# EAGLE design svd20 (EAGLE 6.6.0)
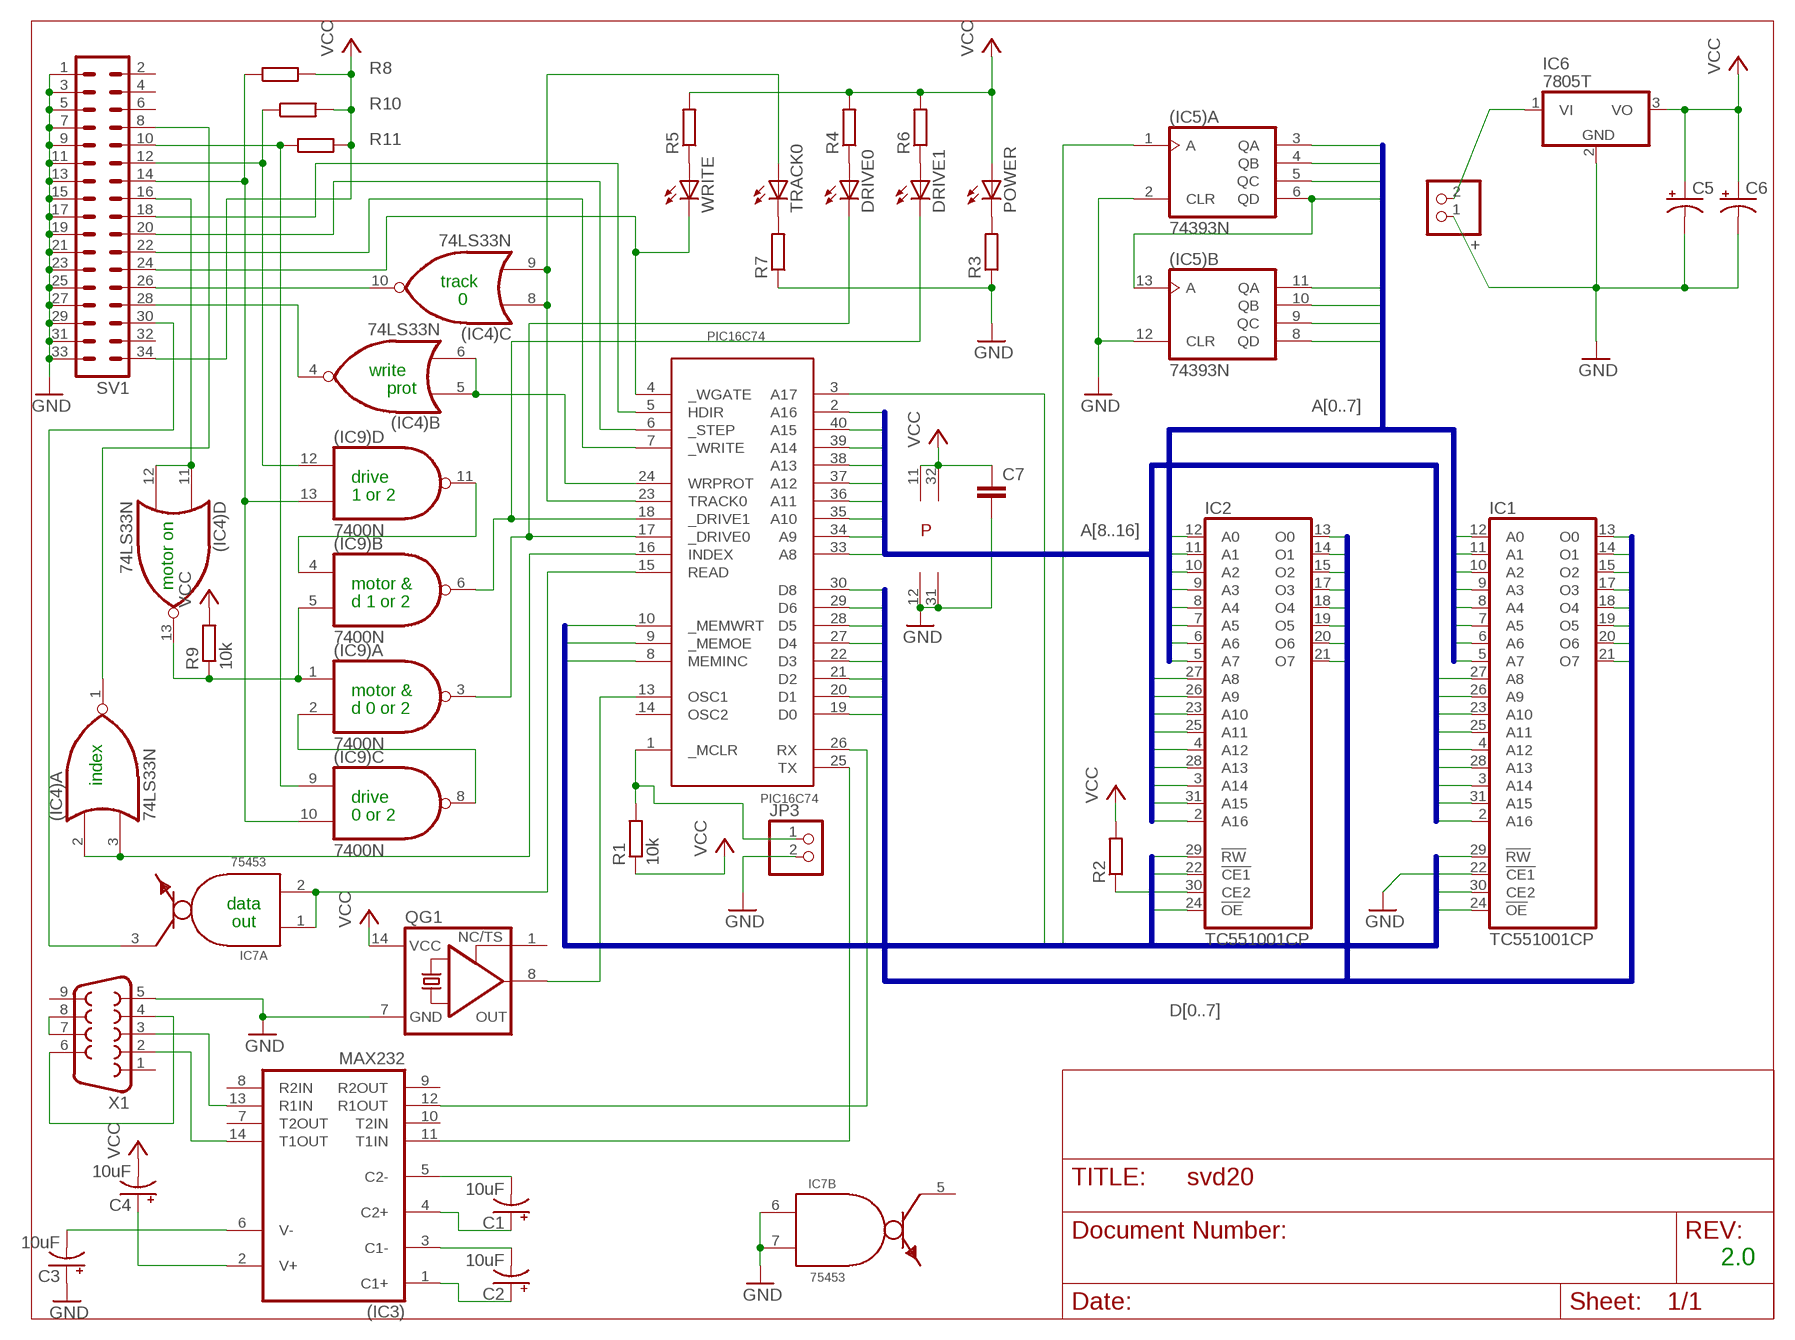
[diagram p0: schematic, sheet 1]

## Parts
(IC3)  MAX232  [DIL16]
(IC4)  74LS33N  [DIL14]
(IC5)  74393N  [DIL14]
(IC9)  7400N  [DIL14]
+  PINHD-1X2  [1X02]
C1  10uF  CPOL-USE2-5  [E2-5]
C2  10uF  CPOL-USE2-5  [E2-5]
C3  10uF  CPOL-USE2-5  [E2-5]
C4  10uF  CPOL-USE2-5  [E2-5]
C5  CPOL-USE2-5  [E2-5]
C6  CPOL-USE2-5  [E2-5]
C7  C2,5-3  [C2.5-3]
DRIVE0  LED3MM  [LED3MM]
DRIVE1  LED3MM  [LED3MM]
IC1  TC551001CP  [DIL32]
IC2  TC551001CP  [DIL32]
IC6  7805T  [TO220H]
IC7  75453  [DIL08]
JP3  PINHD-1X2  [1X02]
PIC16C74  PIC16C74  SVD-PIC16C74  [DIL40]
POWER  LED3MM  [LED3MM]
QG1  XO-14  [DIL14S]
R1  10k  R-EU_0204/5  [0204/5]
R2  R-EU_0204/5  [0204/5]
R3  R-EU_0204/5  [0204/5]
R4  R-EU_0204/5  [0204/5]
R5  R-EU_0204/5  [0204/5]
R6  R-EU_0204/5  [0204/5]
R7  R-EU_0204/5  [0204/5]
R8  R-EU_0204/5  [0204/5]
R9  10k  R-EU_0204/5  [0204/5]
R10  R-EU_0204/5  [0204/5]
R11  R-EU_0204/5  [0204/5]
SV1  ML34  [ML34]
TRACK0  LED3MM  [LED3MM]
WRITE  LED3MM  [LED3MM]
X1  F09HP  [F09HP]

## Nets
!OE: IC1.24(!OE) IC2.24(!OE) PIC16C74.9(_MEMOE)
!WE: IC1.29(!RW) IC2.29(!RW) PIC16C74.10(_MEMWRT)
A0: (IC5).3(A:QA) IC1.12(A0) IC2.12(A0)
A1: (IC5).4(A:QB) IC1.11(A1) IC2.11(A1)
A2: (IC5).5(A:QC) IC1.10(A2) IC2.10(A2)
A3: (IC5).6(A:QD) (IC5).13(B:A) IC1.9(A3) IC2.9(A3)
A4: (IC5).11(B:QA) IC1.8(A4) IC2.8(A4)
A5: (IC5).10(B:QB) IC1.7(A5) IC2.7(A5)
A6: (IC5).9(B:QC) IC1.6(A6) IC2.6(A6)
A7: (IC5).8(B:QD) IC1.5(A7) IC2.5(A7)
A8: IC1.27(A8) IC2.27(A8) PIC16C74.33(A8)
A9: IC1.26(A9) IC2.26(A9) PIC16C74.34(A9)
A10: IC1.23(A10) IC2.23(A10) PIC16C74.35(A10)
A11: IC1.25(A11) IC2.25(A11) PIC16C74.36(A11)
A12: IC1.4(A12) IC2.4(A12) PIC16C74.37(A12)
A13: IC1.28(A13) IC2.28(A13) PIC16C74.38(A13)
A14: IC1.3(A14) IC2.3(A14) PIC16C74.39(A14)
A15: IC1.31(A15) IC2.31(A15) PIC16C74.40(A15)
A16: IC1.2(A16) IC2.2(A16) PIC16C74.2(A16)
A17: IC1.30(CE2) IC2.22(!CE1) PIC16C74.3(A17)
CLK: (IC5).1(A:A) PIC16C74.8(MEMINC)
D0: IC1.13(O0) IC2.13(O0) PIC16C74.19(D0)
D1: IC1.14(O1) IC2.14(O1) PIC16C74.20(D1)
D2: IC1.15(O2) IC2.15(O2) PIC16C74.21(D2)
D3: IC1.17(O3) IC2.17(O3) PIC16C74.22(D3)
D4: IC1.18(O4) IC2.18(O4) PIC16C74.27(D4)
D5: IC1.19(O5) IC2.19(O5) PIC16C74.28(D5)
D6: IC1.20(O6) IC2.20(O6) PIC16C74.29(D6)
D7: IC1.21(O7) IC2.21(O7) PIC16C74.30(D8)
GND [GND]: (IC5).2(A:CLR) (IC5).12(B:CLR) +.1 C3.+ C5.- C6.- C7.2 IC1.22(!CE1) IC6.2(GND) IC7.6(B:I0) IC7.7(B:I1) JP3.2 PIC16C74.12(GND) PIC16C74.31(GND) QG1.7(GND) R3.1 R7.1 SV1.1 SV1.3 SV1.5 SV1.7 SV1.9 SV1.11 SV1.13 SV1.15 SV1.17 SV1.19 SV1.21 SV1.23 SV1.25 SV1.27 SV1.29 SV1.31 SV1.33 X1.5
N$1: IC2.30(CE2) R2.1
N$2: JP3.1 PIC16C74.1(_MCLR) R1.2
N$3: (IC3).1(C1+) C2.+
N$4: (IC3).3(C1-) C2.-
N$5: (IC3).4(C2+) C1.+
N$6: (IC3).5(C2-) C1.-
N$7: (IC3).2(V+) C4.+
N$8: PIC16C74.13(OSC1) QG1.8(OUT)
N$9: (IC3).12(R1OUT) PIC16C74.26(RX)
N$10: (IC9).6(B:O) DRIVE1.K(C) PIC16C74.18(_DRIVE1)
N$11: (IC4).11(D:I0) (IC4).12(D:I1) SV1.16
N$12: (IC9).12(D:I0) R10.1 SV1.12
N$13: (IC4).13(D:O) (IC9).1(A:I0) (IC9).5(B:I1) R9.1
N$14: (IC4).1(A:O) SV1.8
N$15: PIC16C74.4(_WGATE) SV1.24 WRITE.K(C)
N$16: PIC16C74.7(_WRITE) SV1.22
N$17: (IC4).10(C:O) SV1.26
N$18: X1.7 X1.8
N$19: IC7.1(A:I0) IC7.2(A:I1) PIC16C74.15(READ)
N$20: (IC9).4(B:I0) (IC9).11(D:O)
N$22: (IC4).8(C:I0) (IC4).9(C:I1) PIC16C74.23(TRACK0) TRACK0.A
N$23: (IC9).3(A:O) DRIVE0.K(C) PIC16C74.17(_DRIVE0)
N$24: (IC3).11(T1IN) PIC16C74.25(TX)
N$25: (IC3).13(R1IN) X1.3
N$26: X1.4 X1.6
N$27: (IC3).14(T1OUT) X1.2
N$28: (IC3).6(V-) C3.-
N$29 [Output]: (IC4).2(A:I0) (IC4).3(A:I1) PIC16C74.16(INDEX)
N$30 [VCC]: +.2 IC6.1(VI)
N$32: POWER.K(C) R3.2
N$33: DRIVE0.A R4.1
N$34: DRIVE1.A R6.1
N$35: R5.1 WRITE.A
N$36: R7.2 TRACK0.K(C)
N$40 [Output]: IC7.3(A:O) SV1.30
N$41: (IC4).5(B:I0) (IC4).6(B:I1) PIC16C74.24(WRPROT)
N$42: (IC9).9(C:I0) R11.1 SV1.10
N$43: (IC9).2(A:I1) (IC9).8(C:O)
N$45: (IC4).4(B:O) SV1.28
N$47: PIC16C74.6(_STEP) SV1.20
N$48: PIC16C74.5(HDIR) SV1.18
N$51: (IC9).10(C:I1) (IC9).13(D:I1) R8.1 SV1.14
VCC [VCC]: C4.- C5.+ C6.+ C7.1 IC6.3(VO) PIC16C74.11(VCC) PIC16C74.32(VCC) POWER.A QG1.14(VCC) R1.1 R2.2 R4.2 R5.2 R6.2 R8.2 R9.2 R10.2 R11.2 SV1.34
Unconnected: (IC3).7(T2OUT) (IC3).8(R2IN) (IC3).9(R2OUT) (IC3).10(T2IN) IC1.1(NC) IC2.1(NC) IC7.5(B:O) PIC16C74.14(OSC2) QG1.1(TS) SV1.2 SV1.4 SV1.6 SV1.32 X1.1 X1.9

## Buses
D[0..7]
A[0..7]
A[8..16]
A17,!OE,!WE,CLK

## Notes on the sheet
- track
- 0
- write
- prot
- drive
- 1 or 2
- motor on | motor &
- d 1 or 2
- motor &
- d 0 or 2
- index
- drive
- 0 or 2
- data
- out
- 2.0

## Power pins joined to a net without a drawn wire
GND: (IC3).15(GND) (IC4).7(P:GND) (IC5).7(P:GND) (IC9).7(P:GND) IC1.16(GND) IC2.16(GND) IC7.4(P:GND)
VCC: (IC3).16(VCC) (IC4).14(P:VCC) (IC5).14(P:VCC) (IC9).14(P:VCC) IC1.32(VCC) IC2.32(VCC) IC7.8(P:VCC)

## Library data of the parts
(IC3) = maxim:MAX232: RS232 TRANSCEIVER; MF: MAXIM; MPN: MAX232ACPE+; OC_FARNELL: 9723773; OC_NEWARK: 68K4544
(IC4) = 74xx-us:74*33: Quad 2-input NOR buffer, open collector
(IC5) = 74xx-us:74*393: Dual 4-bit decade and binary COUNTER
(IC9) = 74xx-us:74*00: Quad 2-input NAND gate
+ JP3 = pinhead:PINHD-1X2: PIN HEADER
C1-C6 = rcl:CPOL-US: POLARIZED CAPACITOR, American symbol
C7 = capacitor-wima:C: CAPACITOR naming: grid - package width
DRIVE0 DRIVE1 POWER TRACK0 WRITE = led:LED: LED OSRAM: - CHIPLED LG R971, LG N971, LY N971, LG Q971, LY Q971, LO R971, LY R971 LH N974, LH R974 LS Q976, LO Q976, LY Q976 LO Q996 - Hyper CHIPLED LW Q18S LB Q993, LB Q99A, LB R99A - SideLED LS A670, LO A670, LY A670, LG A670, LP A670 LB A673, LV A673, LT A673, LW A673 LH A674 LY A675 LS A676, LA A676, LO A676, LY A676, LW A676 LS A679, LY A679, LG A679 - Hyper Micro SIDELED® LS Y876, LA Y876, LO Y876, LY Y876 LT Y87S - SmartLED LW L88C, LW L88S LB L89C, LB L89S, LG L890 LS L89K, LO L89K, LY L89K LS L896, LA L896, LO L896, LY L896 - TOPLED LS T670, LO T670, LY T670, LG T670, LP T670 LSG T670, LSP T670, LSY T670, LOP T670, LYG T670 LG T671, LOG T671, LSG T671 LB T673, LV T673, LT T673, LW T673 LH T674 LS T676, LA T676, LO T676, LY T676, LB T676, LH T676, LSB T676, LW T676 LB T67C, LV T67C, LT T67C, LS T67K, LO T67K, LY T67K, LW E67C LS E67B, LA E67B, LO E67B, LY E67B, LB E67C, LV E67C, LT E67C LW T67C LS T679, LY T679, LG T679 LS T770, LO T770, LY T770, LG T770, LP T770 LB T773, LV T773, LT T773, LW T773 LH T774 LS E675, LA E675, LY E675, LS T675 LS T776, LA T776, LO T776, LY T776, LB T776 LHGB T686 LT T68C, LB T68C - Hyper Mini TOPLED® LB M676 - Mini TOPLED Santana® LG M470 LS M47K, LO M47K, LY M47K Source: http://www.osram.convergy.de LUXEON: - LUMILED® LXK2-PW12-R00, LXK2-PW12-S00, LXK2-PW14-U00, LXK2-PW14-V00 LXK2-PM12-R00, LXK2-PM12-S00, LXK2-PM14-U00 LXK2-PE12-Q00, LXK2-PE12-R00, LXK2-PE12-S00, LXK2-PE14-T00, LXK2-PE14-U00 LXK2-PB12-K00, LXK2-PB12-L00, LXK2-PB12-M00, LXK2-PB14-N00, LXK2-PB14-P00, LXK2-PB14-Q00 LXK2-PR12-L00, LXK2-PR12-M00, LXK2-PR14-Q00, LXK2-PR14-R00 LXK2-PD12-Q00, LXK2-PD12-R00, LXK2-PD12-S00 LXK2-PH12-R00, LXK2-PH12-S00 LXK2-PL12-P00, LXK2-PL12-Q00, LXK2-PL12-R00 Source: www.luxeon.com KINGBRIGHT: KA-3528ASYC Source: www.kingbright.com
IC1 IC2 = memory:TC551001CP: MEMORY
IC6 = linear:78*: Positive VOLTAGE REGULATOR Source: http://cache.national.com/ds/LM/LM78L05.pdf http://www.fairchildsemi.com/ds/LM/LM7805.pdf
IC7 = Erics:75453: Dual NAND peripheral driver
PIC16C74 = Erics:SVD-PIC16C74
QG1 = crystal:XO-: CRYSTAL; OC_FARNELL: unknown; OC_NEWARK: unknown
R1-R11 = rcl:R-EU_: RESISTOR, European symbol
SV1 = con-harting-ml:ML34: HARTING; OC_FARNELL: unknown; OC_NEWARK: unknown
X1 = con-subd:F09: SUB-D; OC_FARNELL: unknown; OC_NEWARK: unknown

## Net classes
1 VCC: width 0.635 mm
2 GND: width 0.635 mm
3 Output: width 0.635 mm

## Board
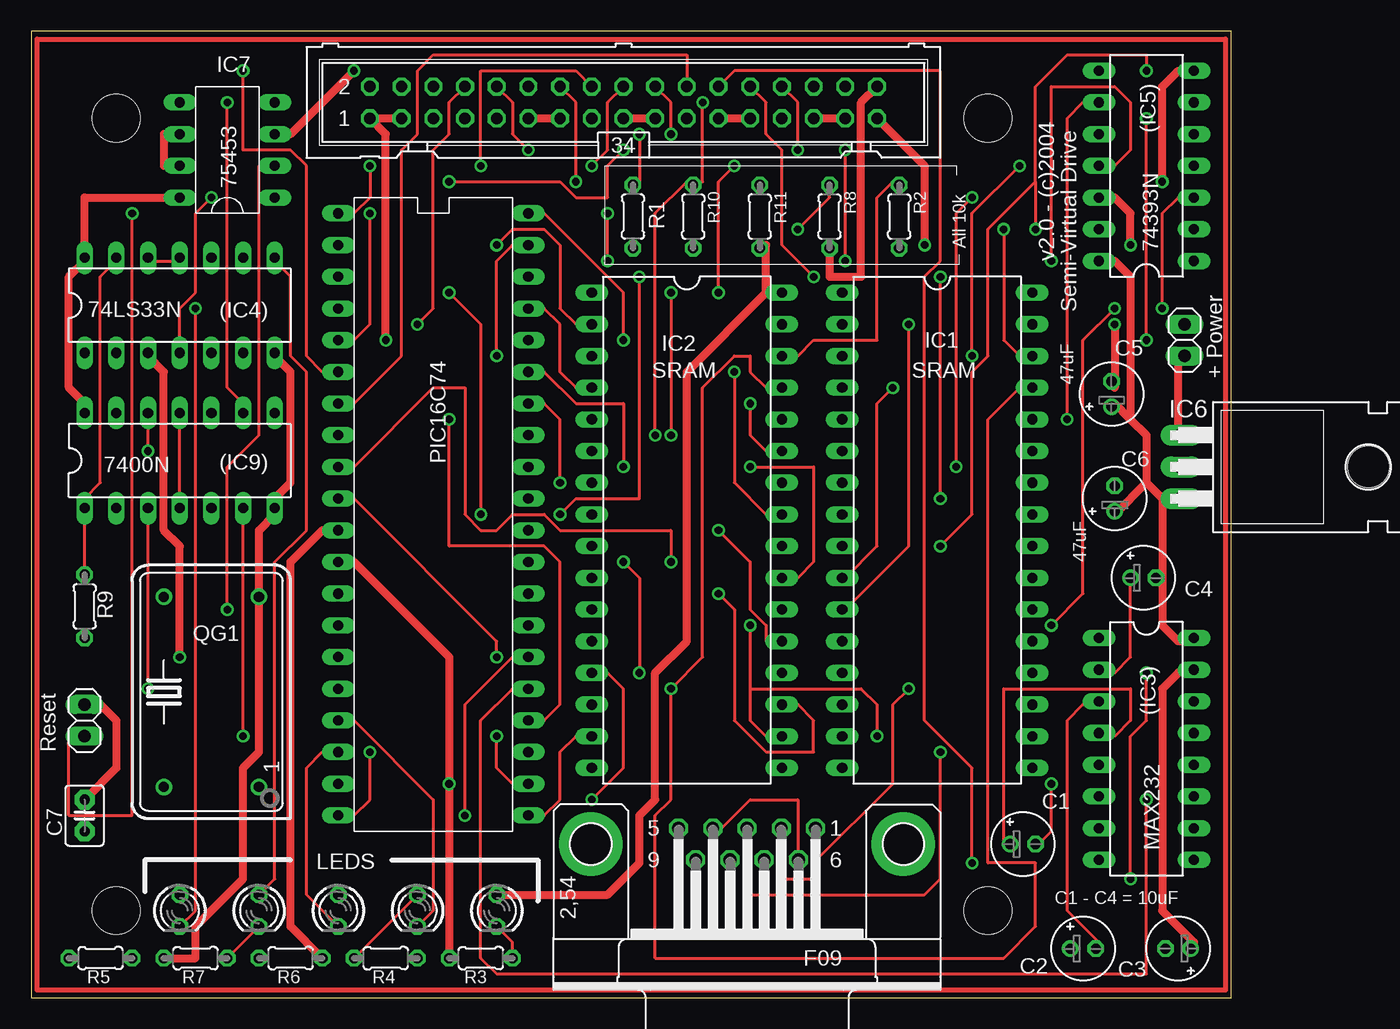
[diagram p1: board, top side]
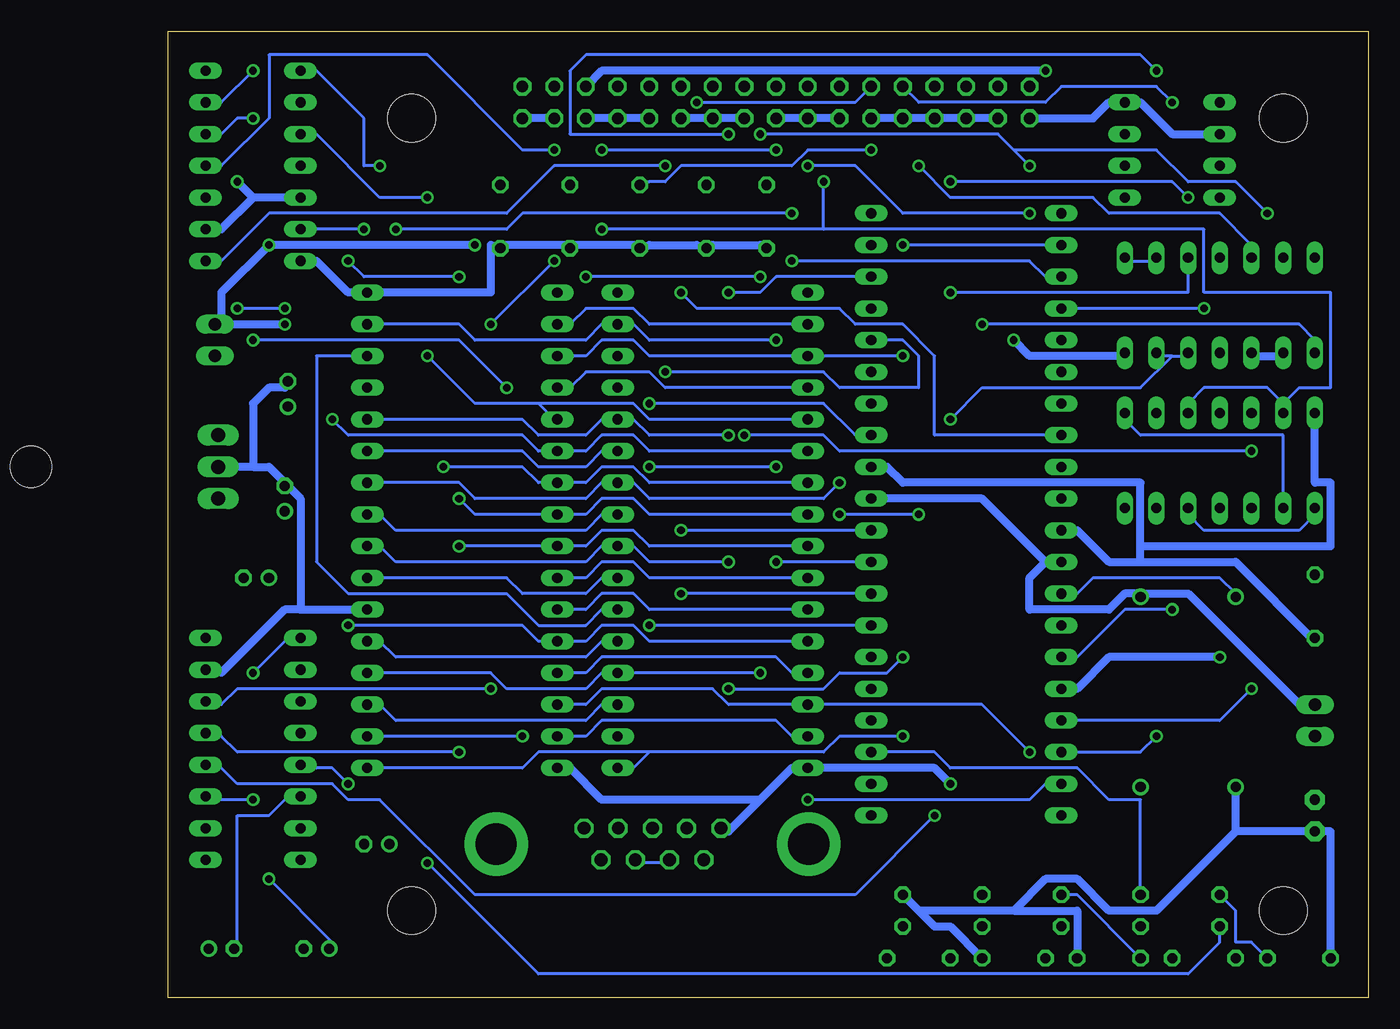
[diagram p2: board, bottom side, seen from below]

Size 96.19 x 77.46 mm. Coordinates in mm from the lower left corner, seen from the top.
Outline: 0,0 96.19,0 96.19,77.46 0,77.46 0,0
Copper layers (1*16): Top 0.035mm / dielectric 1.5mm / Bottom 0.035mm
Design rules "default": minimum track width 10mil, minimum drill 24mil, track to track 8mil, track to pad 8mil, pad to pad 8mil, via to via 8mil, smd to smd 8mil, copper to edge 40mil, drill to drill 8mil, minimum pad ring 10mil, minimum via ring 8mil, stop-mask expansion 4mil, vias tented up to drill 0mil, thermal gap 10mil
Holes 3.81 mm at 6.82,6.98 6.82,70.48 76.67,70.48 76.67,6.98

### Footprints (pad centres in the part's own frame; a part is rotated, then mirrored left to right if it is on the bottom)
DIL16 = drill 0.813 long: 1 -8.89,-3.81; 2 -6.35,-3.81; 3 -3.81,-3.81; 4 -1.27,-3.81; 5 1.27,-3.81; 6 3.81,-3.81; 7 6.35,-3.81; 8 8.89,-3.81; 9 8.89,3.81; 10 6.35,3.81; 11 3.81,3.81; 12 1.27,3.81; 13 -1.27,3.81; 14 -3.81,3.81; 15 -6.35,3.81; 16 -8.89,3.81
DIL14 = drill 0.813 long: 1 -7.62,-3.81; 2 -5.08,-3.81; 3 -2.54,-3.81; 4 0,-3.81; 5 2.54,-3.81; 6 5.08,-3.81; 7 7.62,-3.81; 8 7.62,3.81; 9 5.08,3.81; 10 2.54,3.81; 11 0,3.81; 12 -2.54,3.81; 13 -5.08,3.81; 14 -7.62,3.81
1X02 = drill 1.016 long: 1 -1.27,0; 2 1.27,0
E2-5 = drill 0.813 pad 1.27: + -1.016,0 | drill 0.813 pad 1.27 octagon: - 1.016,0
C2.5-3 = drill 0.813 pad 1.6 octagon: 1 -1.27,0; 2 1.27,0
LED3MM = drill 0.813 octagon: A -1.27,0; K 1.27,0
DIL32 = drill 0.813 long: 1 -19.05,-7.62; 2 -16.51,-7.62; 3 -13.97,-7.62; 4 -11.43,-7.62; 5 -8.89,-7.62; 6 -6.35,-7.62; 7 -3.81,-7.62; 8 -1.27,-7.62; 9 1.27,-7.62; 10 3.81,-7.62; 11 6.35,-7.62; 12 8.89,-7.62; 13 11.43,-7.62; 14 13.97,-7.62; 15 16.51,-7.62; 16 19.05,-7.62; 17 19.05,7.62; 18 16.51,7.62; 19 13.97,7.62; 20 11.43,7.62; 21 8.89,7.62; 22 6.35,7.62; 23 3.81,7.62; 24 1.27,7.62; 25 -1.27,7.62; 26 -3.81,7.62; 27 -6.35,7.62; 28 -8.89,7.62; 29 -11.43,7.62; 30 -13.97,7.62; 31 -16.51,7.62; 32 -19.05,7.62
TO220H = drill 1.118 long: 1 -2.54,-10.16; 2 0,-10.16; 3 2.54,-10.16 | hole 3.302: 0,4.826
DIL08 = drill 0.813 long: 1 -3.81,-3.81; 2 -1.27,-3.81; 3 1.27,-3.81; 4 3.81,-3.81; 5 3.81,3.81; 6 1.27,3.81; 7 -1.27,3.81; 8 -3.81,3.81
DIL40 = drill 0.813 long: 1 -17.78,-12.7; 2 -15.24,-12.7; 3 -12.7,-12.7; 4 -10.16,-12.7; 5 -7.62,-12.7; 6 -5.08,-12.7; 7 -2.54,-12.7; 8 0,-12.7; 9 2.54,-12.7; 10 5.08,-12.7; 11 7.62,-12.7; 12 10.16,-12.7; 13 12.7,-12.7; 14 15.24,-12.7; 15 17.78,-12.7; 16 20.32,-12.7; 17 22.86,-12.7; 18 25.4,-12.7; 19 27.94,-12.7; 20 30.48,-12.7; 21 30.48,2.54; 22 27.94,2.54; 23 25.4,2.54; 24 22.86,2.54; 25 20.32,2.54; 26 17.78,2.54; 27 15.24,2.54; 28 12.7,2.54; 29 10.16,2.54; 30 7.62,2.54; 31 5.08,2.54; 32 2.54,2.54; 33 0,2.54; 34 -2.54,2.54; 35 -5.08,2.54; 36 -7.62,2.54; 37 -10.16,2.54; 38 -12.7,2.54; 39 -15.24,2.54; 40 -17.78,2.54
DIL14S = drill 0.813: 1 -7.62,-3.81; 7 7.62,-3.81; 8 7.62,3.81; 14 -7.62,3.81
0204/5 = drill 0.813 octagon: 1 -2.54,0; 2 2.54,0
ML34 = drill 0.914 octagon: 1 -20.32,-1.27; 2 -20.32,1.27; 3 -17.78,-1.27; 4 -17.78,1.27; 5 -15.24,-1.27; 6 -15.24,1.27; 7 -12.7,-1.27; 8 -12.7,1.27; 9 -10.16,-1.27; 10 -10.16,1.27; 11 -7.62,-1.27; 12 -7.62,1.27; 13 -5.08,-1.27; 14 -5.08,1.27; 15 -2.54,-1.27; 16 -2.54,1.27; 17 0,-1.27; 18 0,1.27; 19 2.54,-1.27; 20 2.54,1.27; 21 5.08,-1.27; 22 5.08,1.27; 23 7.62,-1.27; 24 7.62,1.27; 25 10.16,-1.27; 26 10.16,1.27; 27 12.7,-1.27; 28 12.7,1.27; 29 15.24,-1.27; 30 15.24,1.27; 31 17.78,-1.27; 32 17.78,1.27; 33 20.32,-1.27; 34 20.32,1.27
F09HP = drill 1.016 octagon: 1 -5.486,-1.27; 2 -2.743,-1.27; 3 0,-1.27; 4 2.743,-1.27; 5 5.486,-1.27; 6 -4.115,1.27; 7 -1.372,1.27; 8 1.372,1.27; 9 4.115,1.27 | drill 3.302 pad 5.08: G1 -12.522,0; G2 12.522,0

### Placement (x,y rotation side)
(IC3)  89.37,19.93 270 top
(IC4)  11.9,55.49 0 top
(IC5)  89.37,66.67 90 top
(IC9)  11.9,43.05 0 top
+  92.42,52.7 270 top
C1  79.46,12.31 0 top
C2  84.29,3.93 0 top
C3  91.91,3.93 180 top
C4  89.12,33.65 0 top
C5  86.58,48.38 90 top
C6  86.83,40 90 top
C7  4.28,14.6 90 top
DRIVE0  30.95,6.98 270 top
DRIVE1  24.6,6.98 270 top
IC1  72.61,37.46 270 top
IC2  52.54,37.46 270 top
IC6  102.32,42.54 270 top
IC7  15.71,67.94 90 top
JP3  4.28,22.22 90 top
PIC16C74  37.3,45.08 270 top
POWER  37.3,6.98 270 top
QG1  14.44,24.51 90 top
R1  48.22,62.61 90 top
R2  69.56,62.61 270 top
R3  36.03,3.17 0 top
R4  28.41,3.17 0 top
R5  5.55,3.17 180 top
R6  20.79,3.17 0 top
R7  13.17,3.17 0 top
R8  63.97,62.61 270 top
R9  4.28,31.36 270 top
R10  53.05,62.61 270 top
R11  58.38,62.61 270 top
SV1  47.46,71.75 0 top
TRACK0  18.25,6.98 270 top
WRITE  11.9,6.98 270 top
X1  57.37,12.31 180 top

### Tracks (layer width: path | path; a pad name or v marks a point on that pad's centre or on a via)
!OE  (via drill 0.61)
  Top 0.254: v51.27,34.92 51.27,37.46 42.38,37.46 41.11,38.73 38.57,38.73 37.3,37.46 36.03,37.46 34.76,38.73 34.76,48.89 32.22,48.89 25.87,42.54 PIC16C74.9
  Bottom 0.254: IC1.24 79.21,36.19 77.94,34.92 62.7,34.92 61.43,36.19 IC2.24 58.89,36.19 57.62,34.92 v51.27,34.92
!WE  (via drill 0.61)
  Top 0.254: v37.3,27.3 37.3,28.57 25.87,40 PIC16C74.10 | IC2.29 58.89,48.89 57.62,50.16 57.62,51.43 56.35,51.43 53.81,48.89 53.81,27.3 v51.27,24.76 51.27,15.87 50,14.6 50,3.17 77.94,3.17 80.48,5.71 80.48,10.79 76.67,10.79 76.67,46.35 79.21,48.89 IC1.29
  Bottom 0.254: v37.3,27.3 38.57,26.03 42.38,26.03 43.65,24.76 v51.27,24.76
A0  (via drill 0.61)
  Top 0.254: v90.64,55.24 90.64,62.86 91.91,64.13 (IC5).3 | v86.83,55.24 84.29,52.7 84.29,32.38 v81.75,29.84
  Bottom 0.254: v86.83,55.24 v90.64,55.24 | v81.75,29.84 67.78,29.84 66.51,28.57 IC1.12 62.7,28.57 61.43,29.84 58.89,29.84 57.62,28.57 IC2.12
A1  (via drill 0.61)
  Top 0.254: v65.24,59.05 v65.24,67.94 | v70.32,53.97 70.32,36.19 65.24,31.11 IC1.11
  Bottom 0.254: v65.24,67.94 67.78,67.94 75.4,75.56 88.1,75.56 88.1,70.48 91.91,66.67 (IC5).4 | v70.32,53.97 v65.24,59.05 | IC2.11 57.62,31.11 58.89,32.38 61.43,32.38 62.7,31.11 IC1.11
A2  (via drill 0.61)
  Top 0.254: v89.37,52.7 v89.37,70.48 | v69.05,48.89 67.78,47.62 67.78,36.19 65.24,33.65 IC1.10
  Bottom 0.254: v89.37,70.48 90.64,70.48 91.91,69.21 (IC5).5 | v89.37,52.7 72.86,52.7 v69.05,48.89 | IC2.10 57.62,33.65 58.89,34.92 61.43,34.92 62.7,33.65 IC1.10
A3  (via drill 0.61)
  Top 0.254: 80.48,65.4 80.48,73.02 83.02,75.56 89.37,75.56 v89.37,74.29 | 80.48,65.4 v80.48,61.59 | v72.86,36.19 75.4,38.73 75.4,50.16 76.67,51.43 76.67,61.59 80.48,65.4
  Bottom 0.254: IC2.9 57.62,36.19 58.89,37.46 61.43,37.46 62.7,36.19 IC1.9 v72.86,36.19 | v89.37,74.29 91.91,71.75 (IC5).6 | v80.48,61.59 (IC5).13
A4  (via drill 0.61)
  Top 0.254: v81.75,59.05 81.75,73.02 86.83,73.02 88.1,71.75 88.1,67.94 86.83,66.67 (IC5).11 | v72.86,40 v72.86,57.78
  Bottom 0.254: v81.75,59.05 80.48,57.78 v72.86,57.78 | v72.86,40 71.59,38.73 IC1.8 62.7,38.73 61.43,40 58.89,40 57.62,38.73 IC2.8
A5  (via drill 0.61)
  Top 0.254: v75.4,64.13 74.13,62.86 v74.13,42.54
  Bottom 0.254: v75.4,64.13 79.21,64.13 84.29,69.21 (IC5).10 | v74.13,42.54 67.78,42.54 66.51,41.27 IC1.7 62.7,41.27 61.43,42.54 58.89,42.54 57.62,41.27 IC2.7
A6  (via drill 0.61)
  Top 0.254: v83.02,46.35 83.02,70.48 84.29,71.75 (IC5).9
  Bottom 0.254: v83.02,46.35 81.75,45.08 67.78,45.08 66.51,43.81 IC1.6 62.7,43.81 61.43,45.08 58.89,45.08 57.62,43.81 IC2.6
A7  (via drill 0.61)
  Top 0.254: v79.21,66.67 75.4,62.86 v75.4,51.43
  Bottom 0.254: v79.21,66.67 80.48,66.67 80.48,70.48 84.29,74.29 (IC5).8 | v75.4,51.43 71.59,47.62 66.51,47.62 | 66.51,47.62 65.24,46.35 IC1.5 | 66.51,47.62 58.89,47.62 57.62,46.35 IC2.5
A8  (via drill 0.61)
  Top 0.254: v57.62,47.62 57.62,45.08 58.89,43.81 IC2.27
  Bottom 0.254: IC2.27 61.43,43.81 62.7,42.54 66.51,42.54 67.78,43.81 IC1.27 | v57.62,47.62 43.65,47.62 41.11,45.08 PIC16C74.33
A9  (via drill 0.61)
  Top 0.254: v42.38,41.27 42.38,46.35 41.11,47.62 PIC16C74.34
  Bottom 0.254: IC1.26 72.86,41.27 71.59,40 62.7,40 61.43,41.27 IC2.26 58.89,41.27 57.62,40 43.65,40 v42.38,41.27
A10  (via drill 0.61)
  Top 0.254: v47.46,42.54 47.46,47.62 43.65,47.62 41.11,50.16 PIC16C74.35 | v57.62,42.54 62.7,42.54 62.7,34.92 61.43,33.65 IC2.23
  Bottom 0.254: IC2.23 61.43,33.65 62.7,32.38 67.78,32.38 69.05,33.65 IC1.23 | v47.46,42.54 v57.62,42.54
A11  (via drill 0.61)
  Top 0.254: v56.35,50.16 56.35,41.27 58.89,38.73 IC2.25
  Bottom 0.254: IC2.25 61.43,38.73 62.7,37.46 77.94,37.46 79.21,38.73 IC1.25 | v56.35,50.16 43.65,50.16 42.38,48.89 36.03,48.89 36.03,51.43 37.3,52.7 PIC16C74.36
A12
  Top 0.254: IC2.4 43.65,48.89 42.38,50.16 42.38,53.97 41.11,55.24 PIC16C74.37
  Bottom 0.254: IC1.4 63.97,48.89 62.7,50.16 57.62,50.16 56.35,48.89 IC2.4
A13  (via drill 0.61)
  Top 0.254: v51.27,56.51 v51.27,45.08
  Bottom 0.254: IC1.28 67.78,46.35 66.51,45.08 62.7,45.08 61.43,46.35 IC2.28 58.89,46.35 57.62,45.08 v51.27,45.08 | v51.27,56.51 48.73,56.51 47.46,57.78 PIC16C74.38
A14  (via drill 0.61)
  Top 0.254: v37.3,51.43 37.3,59.05 38.57,60.32 PIC16C74.39
  Bottom 0.254: IC1.3 62.7,51.43 61.43,52.7 58.89,52.7 57.62,51.43 IC2.3 v37.3,51.43
A15  (via drill 0.61)
  Top 0.254: v47.46,52.7 47.46,56.51 41.11,62.86 PIC16C74.40
  Bottom 0.254: IC1.31 72.86,53.97 71.59,52.7 62.7,52.7 61.43,53.97 IC2.31 58.89,53.97 57.62,52.7 v47.46,52.7
A16  (via drill 0.61)
  Top 0.254: v37.3,60.32 38.57,61.59 41.11,61.59 42.38,60.32 42.38,55.24 43.65,53.97 IC2.2
  Bottom 0.254: IC2.2 57.62,53.97 58.89,55.24 62.7,55.24 63.97,53.97 IC1.2 | PIC16C74.2 v37.3,60.32
A17  (via drill 0.61)
  Top 0.254: v46.19,59.05 v46.19,62.86 | v77.94,61.59 77.94,52.7 79.21,51.43 IC1.30
  Bottom 0.254: IC2.22 61.43,31.11 62.7,29.84 66.51,29.84 69.05,32.38 81.75,32.38 84.29,34.92 84.29,51.43 IC1.30 | v46.19,59.05 27.14,59.05 25.87,57.78 PIC16C74.3 | v46.19,62.86 67.78,62.86 69.05,61.59 v77.94,61.59
CLK  (via drill 0.61)
  Top 0.254: v56.35,66.67 55.08,65.4 v55.08,56.51
  Bottom 0.254: v56.35,66.67 65.24,66.67 69.05,62.86 88.1,62.86 91.91,59.05 (IC5).1 | v55.08,56.51 53.81,55.24 42.38,55.24 41.11,53.97 37.3,53.97 34.76,51.43 34.76,45.08 PIC16C74.8
D0  (via drill 0.61)
  Top 0.254: v44.92,15.87 47.46,18.41 47.46,24.76 46.19,26.03 IC2.13
  Bottom 0.254: v44.92,15.87 27.14,15.87 25.87,17.14 PIC16C74.19 | IC1.13 62.7,26.03 61.43,27.3 47.46,27.3 46.19,26.03 IC2.13
D1  (via drill 0.61)
  Top 0.254: v27.14,19.68 27.14,15.87 25.87,14.6 PIC16C74.20
  Bottom 0.254: v27.14,19.68 30.95,23.49 IC2.14 51.27,23.49 52.54,24.76 61.43,24.76 62.7,23.49 IC1.14
D2
  Top 0.254: PIC16C74.21 41.11,14.6 42.38,15.87 42.38,19.68 43.65,20.95 IC2.15
  Bottom 0.254: IC1.15 62.7,20.95 61.43,22.22 47.46,22.22 46.19,20.95 IC2.15
D3  (via drill 0.61)
  Top 0.254: v37.3,20.95 37.3,18.41 38.57,17.14 PIC16C74.22
  Bottom 0.254: v37.3,20.95 42.38,20.95 43.65,19.68 57.62,19.68 | 57.62,19.68 58.89,18.41 IC2.17 | 57.62,19.68 66.51,19.68 67.78,18.41 IC1.17
D4  (via drill 0.61)
  Top 0.254: 57.62,24.76 57.62,22.22 58.89,20.95 IC2.18 | v57.62,29.84 57.62,24.76 | v67.78,20.95 67.78,23.49 66.51,24.76 57.62,24.76
  Bottom 0.254: PIC16C74.27 v57.62,29.84 | v67.78,20.95 IC1.18
D5  (via drill 0.61)
  Top 0.254: v55.08,32.38 56.35,31.11 56.35,22.22 58.89,19.68 62.7,19.68 62.7,22.22 61.43,23.49 IC2.19
  Bottom 0.254: IC2.19 61.43,23.49 62.7,22.22 77.94,22.22 79.21,23.49 IC1.19 | PIC16C74.28 v55.08,32.38
D6  (via drill 0.61)
  Top 0.254: v47.46,34.92 48.73,33.65 v48.73,26.03
  Bottom 0.254: IC1.20 70.32,26.03 69.05,24.76 62.7,24.76 61.43,26.03 IC2.20 v48.73,26.03 | PIC16C74.29 v47.46,34.92
D7  (via drill 0.61)
  Top 0.254: v55.08,37.46 57.62,34.92 57.62,31.11 58.89,29.84 58.89,28.57 IC2.21
  Bottom 0.254: IC2.21 61.43,28.57 62.7,27.3 77.94,27.3 79.21,28.57 IC1.21 | PIC16C74.30 v55.08,37.46
GND  (via drill 0.61)
  Top 0.635: v90.64,65.4 90.64,73.02 91.91,74.29 (IC5).7 | v86.83,53.97 86.83,48.89 C5.- | C3.+ 93.18,4.44 90.64,6.98 90.64,24.76 91.91,26.03 (IC3).15 | v88.1,60.32 88.1,62.86 86.83,64.13 (IC5).12 | R3.1 v33.49,17.14 33.49,27.3 25.87,34.92 PIC16C74.12 | IC7.7 10.63,66.67 10.63,69.21 IC7.6 | SV1.23 SV1.25 | SV1.29 SV1.31 | SV1.3 SV1.1 28.41,69.21 v28.41,52.7 | SV1.11 SV1.13 | SV1.17 SV1.19 | (IC4).7 19.52,51.43 20.79,50.16 20.79,41.27 19.52,40 (IC9).7 19.52,38.73 18.25,37.46 18.25,32.38 QG1.7 18.25,19.68 16.98,18.41 16.98,9.52 13.17,5.71 13.17,3.17 R7.1 | C7.2 6.82,18.41 6.82,22.22 5.55,23.49 JP3.2 | v71.59,60.32 71.59,66.67 SV1.33
  Bottom 0.635: 89.37,64.13 91.91,61.59 (IC5).2 | (IC5).12 89.37,64.13 | 89.37,64.13 v90.64,65.4 | 89.37,42.54 89.37,47.62 88.1,48.89 86.83,48.89 C5.- | 89.37,42.54 IC6.2 | 86.83,41.27 88.1,42.54 89.37,42.54 | 91.91,53.97 v86.83,53.97 | 85.56,31.11 86.83,31.11 91.91,26.03 (IC3).15 | 85.56,31.11 IC1.22 | 86.83,41.27 85.56,40 85.56,31.11 | 86.83,41.27 C6.- | 91.91,53.97 91.91,56.51 v88.1,60.32 v71.59,60.32 | 91.91,53.97 +.1 | 48.73,15.87 51.27,13.33 X1.5 | 48.73,15.87 46.19,18.41 IC2.16 34.76,18.41 v33.49,17.14 | 48.73,15.87 61.43,15.87 63.97,18.41 IC1.16 | 25.87,34.92 30.95,40 PIC16C74.31 | IC7.6 15.71,69.21 18.25,71.75 IC7.4 20.79,71.75 22.06,70.48 SV1.1 | SV1.25 SV1.27 SV1.29 | SV1.31 SV1.33 | SV1.3 SV1.5 SV1.7 SV1.9 SV1.11 | SV1.13 SV1.15 SV1.17 | SV1.19 SV1.21 SV1.23 | 18.25,32.38 14.44,32.38 5.55,23.49 JP3.2 | v28.41,52.7 27.14,51.43 19.52,51.43 (IC4).7 | 25.87,34.92 27.14,33.65 27.14,31.11 20.79,31.11 19.52,32.38 18.25,32.38 | 25.87,34.92 PIC16C74.12 | QG1.7 18.25,32.38
N$1
  Top 0.254: IC2.30 61.43,51.43 62.7,52.7 67.78,52.7 67.78,64.13 69.05,65.4 R2.1
N$2  (via drill 0.61)
  Top 0.254: v27.14,66.67 27.14,64.13 25.87,62.86 PIC16C74.1 | v48.73,69.21 48.73,65.4 R1.2 | v8.09,62.86 8.09,14.6 3.01,14.6 3.01,20.95 JP3.1
  Bottom 0.254: 28.41,67.94 29.68,69.21 v48.73,69.21 | 28.41,67.94 v27.14,66.67 | v8.09,62.86 10.63,65.4 14.44,65.4 16.98,67.94 28.41,67.94
N$3  (via drill 0.61)
  Top 0.254: v88.1,9.52 88.1,20.95 89.37,22.22 v89.37,26.03
  Bottom 0.254: v88.1,9.52 83.02,4.44 C2.+ | v89.37,26.03 86.83,28.57 (IC3).1
N$4
  Top 0.254: C2.- 85.56,4.44 83.02,6.98 83.02,22.22 84.29,23.49 (IC3).3
N$5
  Top 0.254: C1.+ 77.94,12.06 77.94,24.76 88.1,24.76 88.1,22.22 86.83,20.95 (IC3).4
N$6  (via drill 0.61)
  Top 0.254: v81.75,17.14 81.75,13.33 80.48,12.06 C1.-
  Bottom 0.254: v81.75,17.14 83.02,18.41 84.29,18.41 (IC3).5
N$7
  Top 0.254: C4.+ 88.1,27.3 86.83,26.03 (IC3).2
N$8
  Bottom 0.254: QG1.8 10.63,32.38 11.9,33.65 22.06,33.65 23.33,32.38 PIC16C74.13
N$9  (via drill 0.61)
  Top 0.254: v34.76,14.6 34.76,23.49 38.57,27.3 PIC16C74.26
  Bottom 0.254: v34.76,14.6 41.11,8.25 71.59,8.25 79.21,15.87 81.75,15.87 83.02,17.14 90.64,17.14 91.91,18.41 (IC3).12
N$10  (via drill 0.61)
  Top 0.254: v16.98,20.95 (IC9).6 | DRIVE1.K 22.06,8.25 22.06,18.41 23.33,19.68 PIC16C74.18
  Bottom 0.254: v16.98,20.95 18.25,19.68 PIC16C74.18
N$11  (via drill 0.61)
  Top 0.254: (IC4).12 9.36,59.05 11.9,59.05 (IC4).11 | SV1.16 43.65,74.29 36.03,74.29 v36.03,66.67
  Bottom 0.254: v36.03,66.67 33.49,64.13 22.06,64.13 20.79,62.86 11.9,62.86 9.36,60.32 (IC4).12
N$12  (via drill 0.61)
  Top 0.254: v50,45.08 50,62.86 52.54,65.4 R10.1 53.81,65.4 v53.81,71.75 | v9.36,43.81 (IC9).12
  Bottom 0.254: v9.36,43.81 42.38,43.81 43.65,45.08 v50,45.08 | SV1.12 41.11,71.75 v53.81,71.75
N$13
  Top 0.254: 4.28,33.65 R9.1 (IC9).1 4.28,40 5.55,41.27 5.55,57.78 6.82,59.05 (IC4).13
  Bottom 0.254: (IC9).5 14.44,38.73 13.17,37.46 5.55,37.46 4.28,38.73 (IC9).1
N$14  (via drill 0.61)
  Top 0.254: v30.95,53.97 32.22,55.24 32.22,67.94 33.49,69.21 33.49,71.75 SV1.8
  Bottom 0.254: v30.95,53.97 5.55,53.97 4.28,52.7 (IC4).1
N$15  (via drill 0.61)
  Top 0.254: WRITE.K 13.17,6.98 v13.17,55.24 | SV1.24 56.35,74.29 72.86,74.29 72.86,59.05 71.59,57.78 71.59,22.22 75.4,18.41 v75.4,10.79
  Bottom 0.254: v13.17,55.24 PIC16C74.4 | v75.4,10.79 66.51,1.9 14.44,1.9 11.9,4.44 WRITE.K
N$16
  Top 0.254: SV1.22 52.54,75.56 32.22,75.56 30.95,74.29 30.95,69.21 29.68,67.94 29.68,51.43 25.87,47.62 PIC16C74.7
N$17  (via drill 0.61)
  Top 0.254: v33.49,56.51 36.03,53.97 v36.03,38.73 | v42.38,38.73 43.65,40 48.73,40 v48.73,57.78 | v62.7,57.78 60.16,60.32 60.16,67.94 58.89,69.21 58.89,71.75 SV1.26
  Bottom 0.254: v33.49,56.51 14.44,56.51 (IC4).10 | v36.03,38.73 v42.38,38.73 | v48.73,57.78 v62.7,57.78
N$18
  Bottom 0.254: X1.8 56.35,10.79 58.89,10.79 X1.7
N$19  (via drill 0.61)
  Top 0.254: 18.25,64.13 18.25,66.67 IC7.2 | v15.71,31.11 15.71,42.54 18.25,45.08 18.25,64.13 | 18.25,64.13 IC7.1
  Bottom 0.254: v15.71,31.11 19.52,31.11 23.33,27.3 PIC16C74.15
N$20
  Top 0.254: (IC9).4 (IC9).11
N$22
  Top 0.254: TRACK0.A 19.52,9.52 19.52,34.92 22.06,37.46 22.06,50.16 20.79,51.43 20.79,57.78 19.52,59.05 (IC4).8
  Bottom 0.254: (IC4).9 16.98,59.05 19.52,59.05 (IC4).8 | TRACK0.A 18.25,15.87 20.79,15.87 23.33,18.41 33.49,18.41 34.76,19.68 PIC16C74.23
N$23  (via drill 0.61)
  Top 0.254: v9.36,24.76 (IC9).3 | DRIVE0.K 32.22,6.98 32.22,15.87 25.87,22.22 PIC16C74.17
  Bottom 0.254: v9.36,24.76 11.9,22.22 PIC16C74.17
N$24  (via drill 0.61)
  Top 0.254: v89.37,15.87 89.37,1.9 37.3,1.9 36.03,3.17 36.03,22.22 38.57,24.76 PIC16C74.25
  Bottom 0.254: v89.37,15.87 91.91,15.87 (IC3).11
N$25  (via drill 0.61)
  Top 0.254: v72.86,19.68 72.86,9.52 71.59,8.25 57.62,8.25 57.62,13.33 X1.3
  Bottom 0.254: v72.86,19.68 90.64,19.68 91.91,20.95 (IC3).13
N$26
  Top 0.254: X1.4 55.08,13.33 57.62,15.87 61.43,15.87 61.43,10.79 X1.6
N$27  (via drill 0.61)
  Top 0.254: v70.32,24.76 69.05,23.49 69.05,17.14 62.7,10.79 62.7,9.52 60.16,9.52 60.16,13.33 X1.2
  Bottom 0.254: v70.32,24.76 90.64,24.76 91.91,23.49 (IC3).14
N$28
  Bottom 0.254: C3.- 90.64,4.44 90.64,14.6 88.1,14.6 86.83,15.87 (IC3).6
N$29  (via drill 0.61)
  Top 0.635: v11.9,27.3 11.9,36.19 10.63,37.46 10.63,50.16 9.36,51.43 (IC4).3
  Bottom 0.635: (IC4).2 6.82,51.43 9.36,51.43 (IC4).3 | v11.9,27.3 20.79,27.3 23.33,24.76 PIC16C74.16
N$30
  Top 0.635: +.2 91.91,51.43 91.91,45.08 IC6.1
N$32
  Top 0.254: POWER.K 38.57,4.44 R3.2
N$33
  Top 0.254: R4.1 DRIVE0.A
N$34
  Bottom 0.254: DRIVE1.A 23.33,8.25 R6.1
N$35
  Bottom 0.254: WRITE.A 10.63,6.98 10.63,4.44 9.36,4.44 R5.1
N$36
  Top 0.254: R7.2 TRACK0.K
N$37
  Top 0.406: 0.47,76.83 95.72,76.83 95.72,0.63 0.47,0.63 0.47,76.83
N$40  (via drill 0.61)
  Top 0.635: v25.87,74.29 20.79,69.21 IC7.3
  Bottom 0.635: v25.87,74.29 61.43,74.29 SV1.30
N$41  (via drill 0.61)
  Top 0.254: v33.49,46.35 33.49,36.19 41.11,36.19 42.38,34.92 42.38,23.49 41.11,22.22 PIC16C74.24
  Bottom 0.254: 15.71,51.43 16.98,51.43 (IC4).6 | 15.71,51.43 14.44,51.43 (IC4).5 | v33.49,46.35 30.95,48.89 18.25,48.89 15.71,51.43
N$42  (via drill 0.61)
  Top 0.254: v15.71,71.75 15.71,48.89 16.98,47.62 (IC9).9 | v39.84,67.94 38.57,69.21 38.57,71.75 SV1.10
  Bottom 0.254: v15.71,71.75 16.98,73.02 24.6,73.02 25.87,71.75 36.03,71.75 SV1.10 | v39.84,67.94 44.92,67.94 46.19,66.67 55.08,66.67 56.35,65.4 57.62,65.4 R11.1
N$43
  Bottom 0.254: (IC9).2 6.82,45.08 18.25,45.08 19.52,46.35 (IC9).8
N$45  (via drill 0.61)
  Top 0.254: v14.44,64.13 13.17,62.86 13.17,56.51 11.9,55.24 (IC4).4 | v33.49,65.4 42.38,65.4 43.65,64.13 46.19,64.13 46.19,66.67 v47.46,67.94 | v61.43,67.94 61.43,71.75 SV1.28
  Bottom 0.254: v14.44,64.13 15.71,65.4 v33.49,65.4 | v47.46,67.94 v61.43,67.94
N$47  (via drill 0.61)
  Top 0.254: v16.98,74.29 16.98,67.94 20.79,67.94 22.06,66.67 22.06,51.43 23.33,50.16 PIC16C74.6 | v51.27,69.21 51.27,71.75 SV1.20
  Bottom 0.254: v16.98,74.29 18.25,75.56 62.7,75.56 63.97,74.29 63.97,69.21 v51.27,69.21
N$48  (via drill 0.61)
  Top 0.254: v27.14,62.86 27.14,53.97 25.87,52.7 PIC16C74.5 | v44.92,66.67 46.19,67.94 46.19,71.75 SV1.18
  Bottom 0.254: v27.14,62.86 37.3,62.86 41.11,66.67 v44.92,66.67
N$51  (via drill 0.61)
  Top 0.254: SV1.14 43.65,71.75 v43.65,65.4 | v61.43,61.59 63.97,64.13 R8.1 63.97,65.4
  Bottom 0.254: 6.82,47.62 8.09,48.89 13.17,48.89 14.44,47.62 (IC9).10 | 43.65,61.59 v43.65,65.4 | 43.65,61.59 v61.43,61.59 | 6.82,47.62 5.55,48.89 3.01,48.89 3.01,56.51 13.17,56.51 13.17,61.59 43.65,61.59 | (IC9).13 6.82,47.62
VCC
  Top 0.635: 58.89,56.51 58.89,60.32 R11.2 | SV1.34 66.51,71.75 66.51,57.78 63.97,57.78 R8.2 63.97,60.32 | 90.64,33.65 90.64,29.84 91.91,28.57 (IC3).16 | 88.1,46.35 89.37,45.08 89.37,41.27 | 88.1,46.35 86.83,47.62 C5.+ | 89.37,41.27 90.64,40 | 89.37,41.27 86.83,38.73 C6.+ | 88.1,46.35 88.1,57.78 86.83,59.05 (IC5).14 | 90.64,40 90.64,33.65 | 90.64,33.65 C4.- | 90.64,40 IC6.3 | (IC9).14 4.28,47.62 3.01,48.89 3.01,57.78 4.28,59.05 (IC4).14 4.28,64.13 IC7.8 | R6.2 20.79,5.71 20.79,34.92 23.33,37.46 PIC16C74.11 | 58.89,56.51 52.54,50.16 52.54,28.57 50,26.03 50,15.87 48.73,14.6 48.73,10.79 46.19,8.25 POWER.A | 58.89,56.51 IC2.32
  Bottom 0.635: R1.1 48.73,60.32 52.54,60.32 R10.2 53.81,60.32 57.62,60.32 R11.2 58.89,60.32 63.97,60.32 | 63.97,60.32 69.05,60.32 R2.2 70.32,60.32 70.32,56.51 IC1.32 81.75,56.51 84.29,59.05 (IC5).14 | 63.97,60.32 R8.2 | 10.63,13.33 QG1.14 10.63,17.14 | 10.63,13.33 C7.1 3.01,13.33 R5.2 | 36.03,6.98 34.76,5.71 33.49,5.71 R4.2 | 36.03,6.98 POWER.A | R6.2 23.33,6.98 28.41,6.98 | 28.41,6.98 36.03,6.98 | 18.25,34.92 10.63,34.92 4.28,28.57 R9.2 | 18.25,34.92 20.79,34.92 23.33,37.46 PIC16C74.11 | 18.25,34.92 18.25,36.19 | 18.25,36.19 18.25,41.27 37.3,41.27 38.57,42.54 PIC16C74.32 | 10.63,13.33 16.98,6.98 20.79,6.98 23.33,9.52 25.87,9.52 28.41,6.98 | 18.25,36.19 3.01,36.19 3.01,41.27 4.28,41.27 (IC9).14

### Text on the board
tPlace: LEDS | C1 - C4 = 10uF
tNames: All 10k | v2.0 - (c)2004 | Semi-Virtual Drive | SRAM | SRAM | 47uF | + Power | 47uF | Reset